# EAGLE design HW2_Schematics (EAGLE 9.3.0)
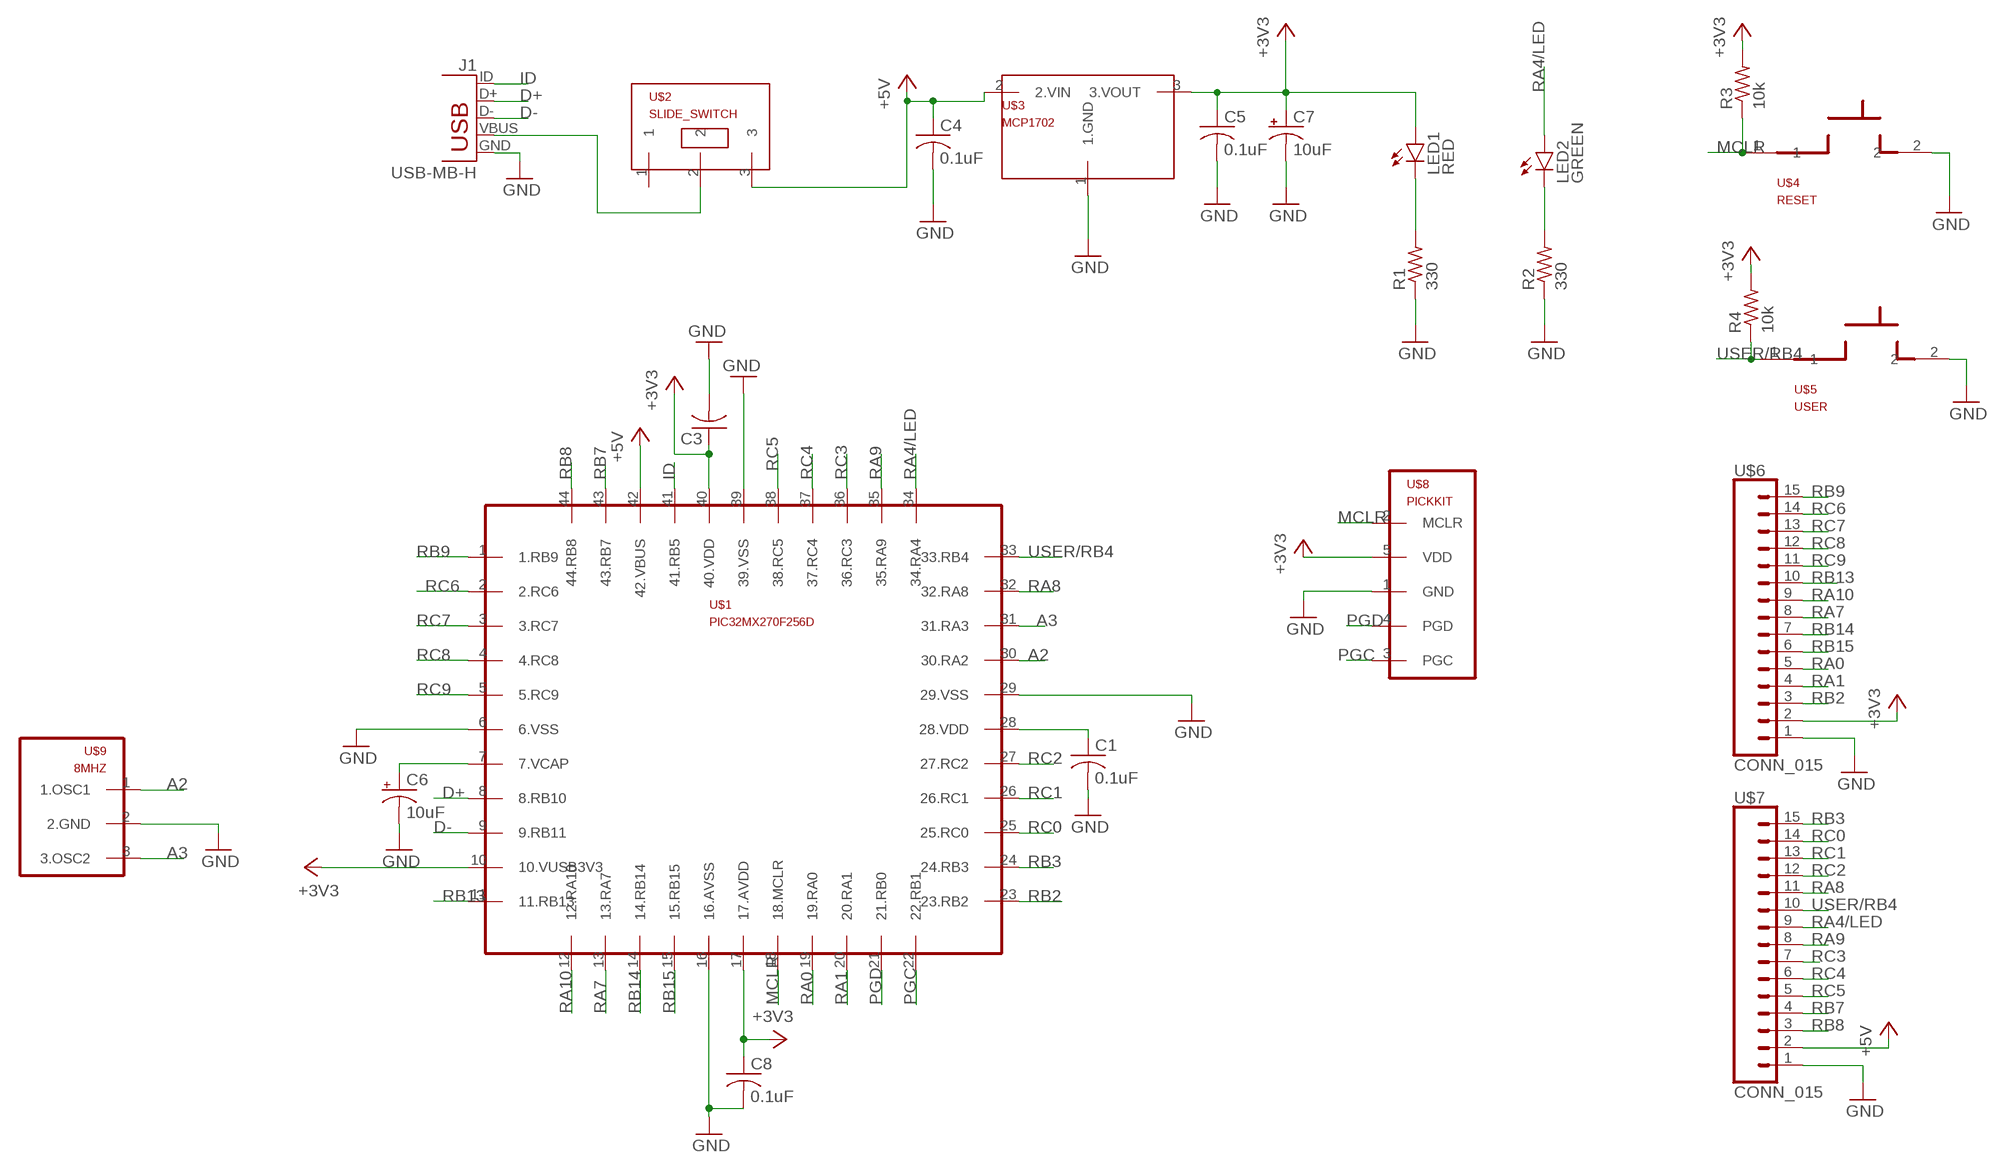
[diagram p0: schematic, sheet 1]

## Parts
C1  0.1uF  C-US025-025X050  [C025-025X050]
C3  C-US025-025X050  [C025-025X050]
C4  0.1uF  C-US025-025X050  [C025-025X050]
C5  0.1uF  C-US025-025X050  [C025-025X050]
C6  10uF  CPOL-USB45181B  [B45181B]
C7  10uF  CPOL-USB45181B  [B45181B]
C8  0.1uF  C-US025-025X050  [C025-025X050]
J1  USB-MB-H  [USB-MB-H]
LED1  RED  LED3MM  [LED3MM]
LED2  GREEN  LED3MM  [LED3MM]
R1  330  R-US_0207/10  [0207/10]
R2  330  R-US_0207/10  [0207/10]
R3  10k  R-US_0207/10  [0207/10]
R4  10k  R-US_0207/10  [0207/10]
U$1  PIC32MX270F256D  [TQFP44]
U$2  SLIDE_SWITCH  [SLIDE_SWITCH]
U$3  MCP1702  [TO92]
U$4  RESET  PUSHBUTTON  [PUSHBUTTON]
U$5  USER  PUSHBUTTON  [PUSHBUTTON]
U$6  CONN_015  [1X15]
U$7  CONN_015  [1X15]
U$8  PICKKIT  [1X05]
U$9  8MHZ  OSC  [OSC]

## Nets
+3V3: C3.1 C5.1 C7.+ C8.1 LED1.A R3.2 R4.2 U$1.10(10.VUSB3V3) U$1.17(17.AVDD) U$1.40(40.VDD) U$3.3(3.VOUT) U$6.2 U$8.5(VDD)
+5V: C4.1 U$1.42(42.VBUS) U$2.3 U$3.2(2.VIN) U$7.2
A2: U$1.30(30.RA2) U$9.1(1.OSC1)
A3: U$1.31(31.RA3) U$9.3(3.OSC2)
D+: J1.D+ U$1.8(8.RB10)
D-: J1.D- U$1.9(9.RB11)
GND: C1.2 C3.2 C4.2 C5.2 C6.- C7.- C8.2 J1.GND R1.1 R2.1 U$1.6(6.VSS) U$1.16(16.AVSS) U$1.29(29.VSS) U$1.39(39.VSS) U$3.1(1.GND) U$4.2 U$5.2 U$6.1 U$7.1 U$8.1(GND) U$9.2(2.GND)
ID: J1.ID U$1.41(41.RB5)
MCLR: R3.1 U$1.18(18.MCLR) U$4.1 U$8.2(MCLR)
N$1: J1.VBUS U$2.2
N$2: LED1.K(C) R1.2
N$3: LED2.K(C) R2.2
N$4: C6.+ U$1.7(7.VCAP)
N$5: C1.1 U$1.28(28.VDD)
PGC: U$1.22(22.RB1) U$8.3(PGC)
PGD: U$1.21(21.RB0) U$8.4(PGD)
RA0: U$1.19(19.RA0) U$6.5
RA1: U$1.20(20.RA1) U$6.4
RA4/LED: LED2.A U$1.34(34.RA4) U$7.9
RA7: U$1.13(13.RA7) U$6.8
RA8: U$1.32(32.RA8) U$7.11
RA9: U$1.35(35.RA9) U$7.8
RA10: U$1.12(12.RA10) U$6.9
RB2: U$1.23(23.RB2) U$6.3
RB3: U$1.24(24.RB3) U$7.15
RB7: U$1.43(43.RB7) U$7.4
RB8: U$1.44(44.RB8) U$7.3
RB9: U$1.1(1.RB9) U$6.15
RB13: U$1.11(11.RB13) U$6.10
RB14: U$1.14(14.RB14) U$6.7
RB15: U$1.15(15.RB15) U$6.6
RC0: U$1.25(25.RC0) U$7.14
RC1: U$1.26(26.RC1) U$7.13
RC2: U$1.27(27.RC2) U$7.12
RC3: U$1.36(36.RC3) U$7.7
RC4: U$1.37(37.RC4) U$7.6
RC5: U$1.38(38.RC5) U$7.5
RC6: U$1.2(2.RC6) U$6.14
RC7: U$1.3(3.RC7) U$6.13
RC8: U$1.4(4.RC8) U$6.12
RC9: U$1.5(5.RC9) U$6.11
USER/RB4: R4.1 U$1.33(33.RB4) U$5.1 U$7.10
Unconnected: U$2.1

## Library data of the parts
C1 C3-C5 C8 = rcl:C-US: CAPACITOR, American symbol; SPICEPREFIX: C
C6 C7 = rcl:CPOL-US: POLARIZED CAPACITOR, American symbol; SPICEPREFIX: C
J1 = Honghe_Qi_ME433_HW2_Library:USB: USB Connectors USB-B-PTH is fully proven SKU : PRT-00139/CONN-08278 USB-miniB is fully proven SKU : PRT-00587 USB-A-PCB is untested. USB-A-H is throughly reviewed, but untested. Spark Fun Electronics SKU : PRT-00437 USB-B-SMT is throughly reviewed, but untested. Needs silkscreen touching up. USB-A-S has not been used/tested USB-MB-H has not been used/tested USB-MICROB has been used. CONN-09505
LED1 LED2 = led:LED: LED OSRAM: - CHIPLED LG R971, LG N971, LY N971, LG Q971, LY Q971, LO R971, LY R971 LH N974, LH R974 LS Q976, LO Q976, LY Q976 LO Q996 - Hyper CHIPLED LW Q18S LB Q993, LB Q99A, LB R99A - SideLED LS A670, LO A670, LY A670, LG A670, LP A670 LB A673, LV A673, LT A673, LW A673 LH A674 LY A675 LS A676, LA A676, LO A676, LY A676, LW A676 LS A679, LY A679, LG A679 - Hyper Micro SIDELED® LS Y876, LA Y876, LO Y876, LY Y876 LT Y87S - SmartLED LW L88C, LW L88S LB L89C, LB L89S, LG L890 LS L89K, LO L89K, LY L89K LS L896, LA L896, LO L896, LY L896 - TOPLED LS T670, LO T670, LY T670, LG T670, LP T670 LSG T670, LSP T670, LSY T670, LOP T670, LYG T670 LG T671, LOG T671, LSG T671 LB T673, LV T673, LT T673, LW T673 LH T674 LS T676, LA T676, LO T676, LY T676, LB T676, LH T676, LSB T676, LW T676 LB T67C, LV T67C, LT T67C, LS T67K, LO T67K, LY T67K, LW E67C LS E67B, LA E67B, LO E67B, LY E67B, LB E67C, LV E67C, LT E67C LW T67C LS T679, LY T679, LG T679 LS T770, LO T770, LY T770, LG T770, LP T770 LB T773, LV T773, LT T773, LW T773 LH T774 LS E675, LA E675, LY E675, LS T675 LS T776, LA T776, LO T776, LY T776, LB T776 LHGB T686 LT T68C, LB T68C - Hyper Mini TOPLED® LB M676 - Mini TOPLED Santana® LG M470 LS M47K, LO M47K, LY M47K Source: http://www.osram.convergy.de LUXEON: - LUMILED® LXK2-PW12-R00, LXK2-PW12-S00, LXK2-PW14-U00, LXK2-PW14-V00 LXK2-PM12-R00, LXK2-PM12-S00, LXK2-PM14-U00 LXK2-PE12-Q00, LXK2-PE12-R00, LXK2-PE12-S00, LXK2-PE14-T00, LXK2-PE14-U00 LXK2-PB12-K00, LXK2-PB12-L00, LXK2-PB12-M00, LXK2-PB14-N00, LXK2-PB14-P00, LXK2-PB14-Q00 LXK2-PR12-L00, LXK2-PR12-M00, LXK2-PR14-Q00, LXK2-PR14-R00 LXK2-PD12-Q00, LXK2-PD12-R00, LXK2-PD12-S00 LXK2-PH12-R00, LXK2-PH12-S00 LXK2-PL12-P00, LXK2-PL12-Q00, LXK2-PL12-R00 Source: www.luxeon.com KINGBRIGHT: KA-3528ASYC Source: www.kingbright.com
R1-R4 = rcl:R-US_: RESISTOR, American symbol; SPICEPREFIX: R
U$1 = Honghe_Qi_ME433_HW2_Library:PIC32MX270F256D
U$2 = Honghe_Qi_ME433_HW2_Library:SLIDE_SWITCH
U$3 = Honghe_Qi_ME433_HW2_Library:MCP1702
U$4 U$5 = Honghe_Qi_ME433_HW2_Library:PUSHBUTTON
U$6 U$7 = Honghe_Qi_ME433_HW2_Library:CONN_015
U$8 = Honghe_Qi_ME433_HW2_Library:PICKKIT
U$9 = Honghe_Qi_ME433_HW2_Library:OSC

## Board
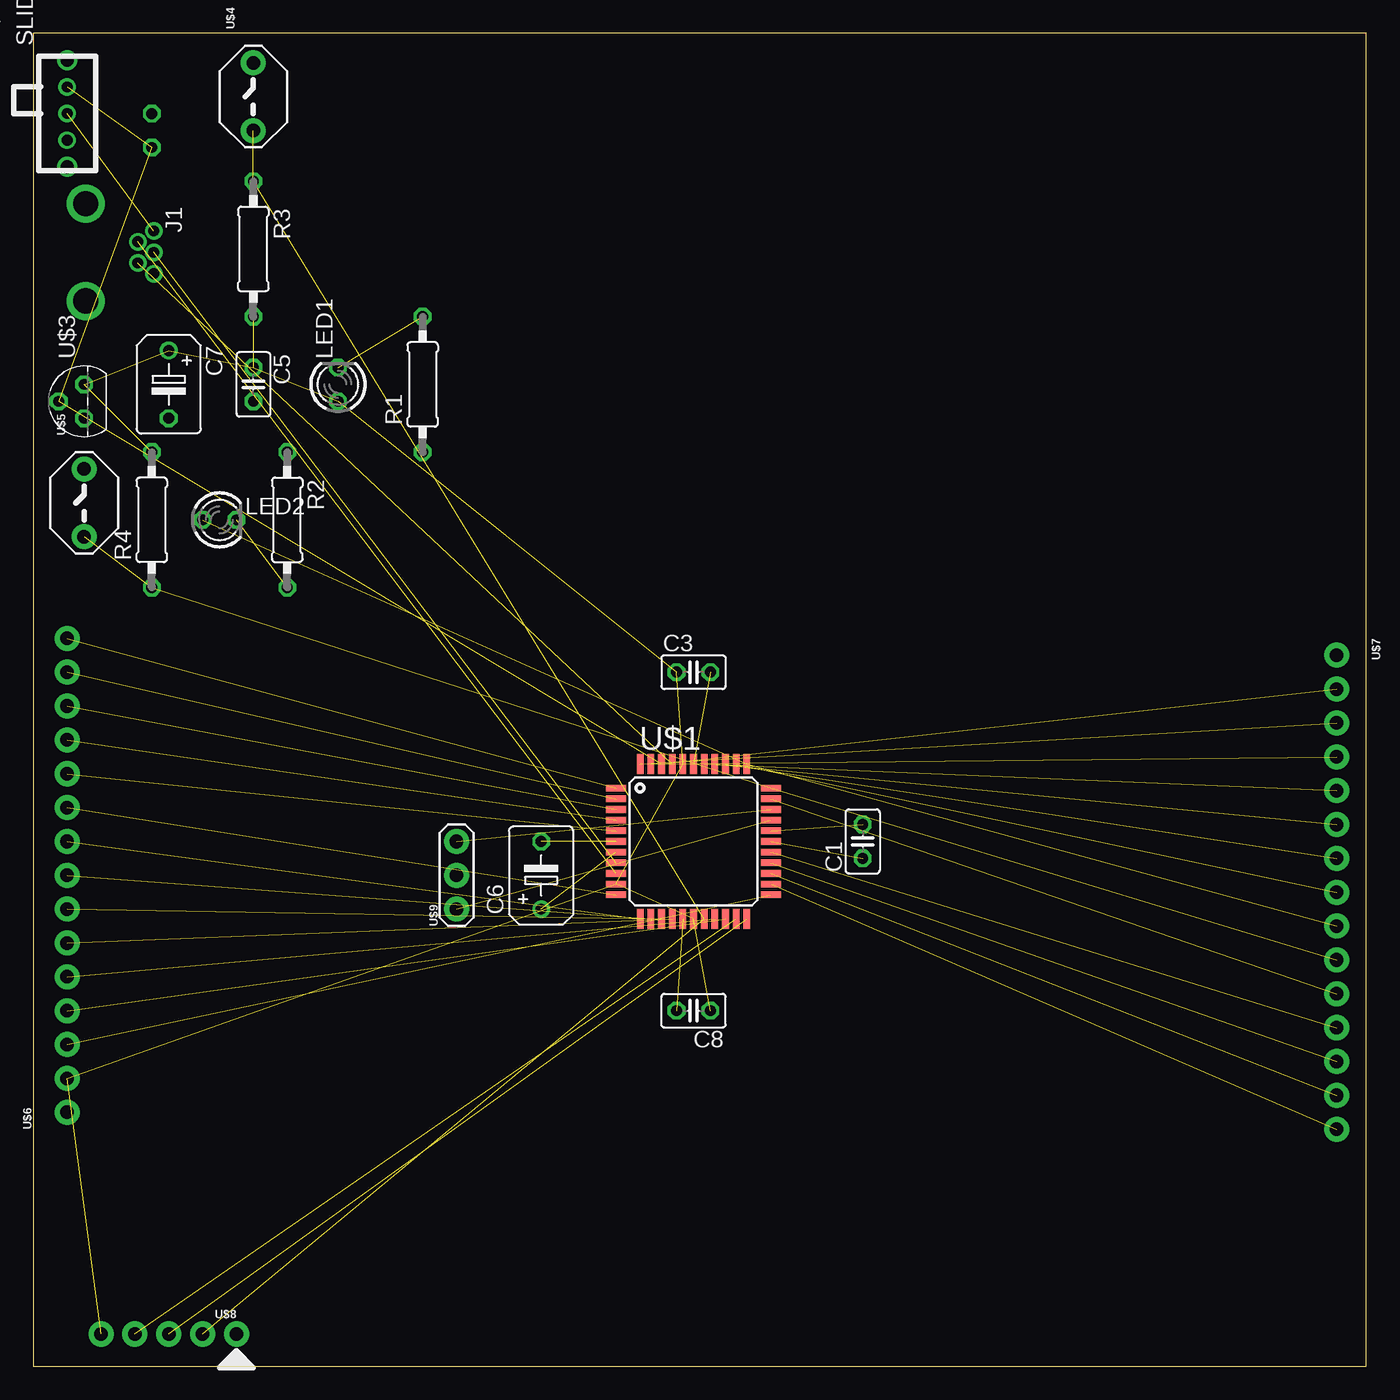
[diagram p1: board, top side]
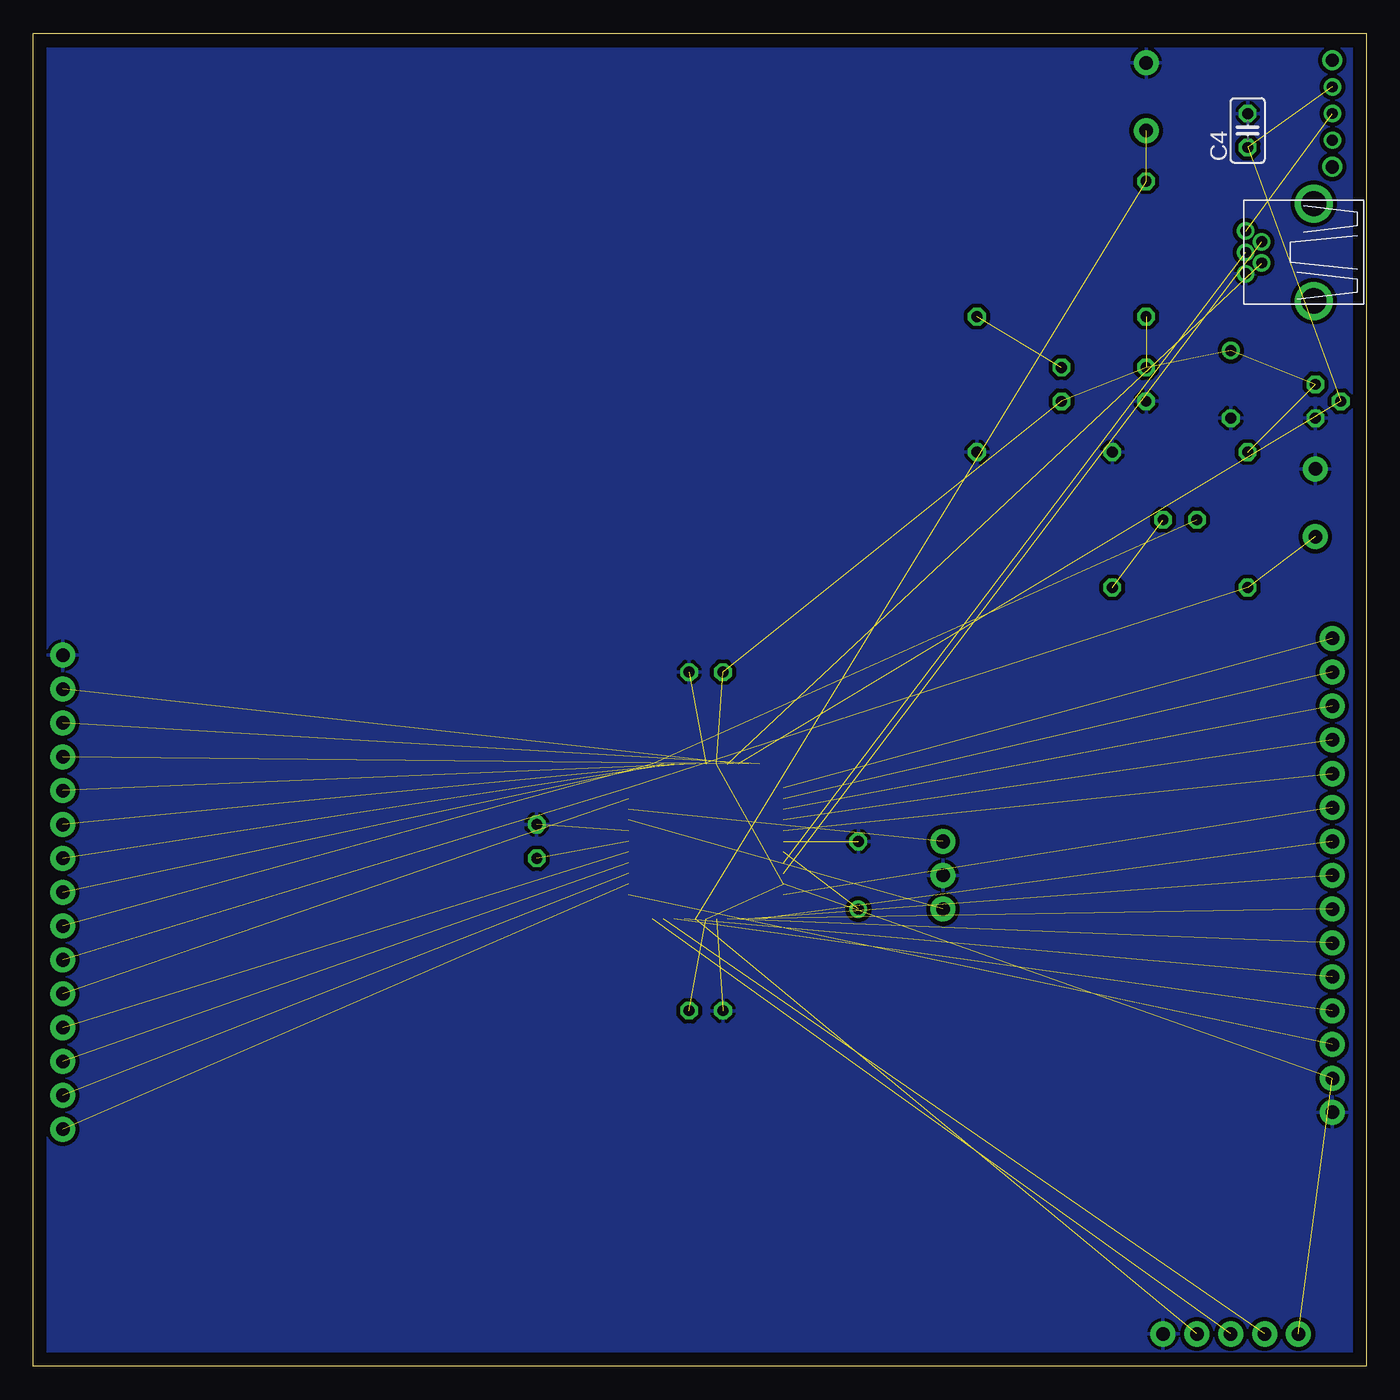
[diagram p2: board, bottom side, seen from below]

Size 100 x 100 mm. Coordinates in mm from the lower left corner, seen from the top.
Outline: 0,0 100,0 100,100 0,100 0,0
Copper layers (1*16): Top 0.035mm / dielectric 1.5mm / Bottom 0.035mm
Design rules "default": minimum track width 6mil, minimum drill 0.35mm, track to track 6mil, track to pad 6mil, pad to pad 6mil, via to via 6mil, smd to smd 6mil, copper to edge 40mil, drill to drill 6mil, minimum pad ring 10mil, minimum via ring 8mil, stop-mask expansion 4mil, vias tented up to drill 0mil, thermal gap 10mil

### Footprints (pad centres in the part's own frame; a part is rotated, then mirrored left to right if it is on the bottom)
C025-025X050 = drill 0.813 octagon: 1 -1.27,0; 2 1.27,0
B45181B = drill 0.813: + -2.54,0 | drill 0.813 octagon: - 2.54,0
USB-MB-H = drill 0.8: D+ 5.1,0; D- 3.9,0.8; GND 5.1,-1.6; ID 3.9,-0.8; VBUS 5.1,1.6 | drill 1.9: P$6 0,-3.65; P$7 0,3.65
LED3MM = drill 0.813 octagon: A -1.27,0; K 1.27,0
0207/10 = drill 0.813 octagon: 1 -5.08,0; 2 5.08,0
TQFP44 = smd 1.5 x 0.5: 1 -5.8,4; 2 -5.8,3.2; 3 -5.8,2.4; 4 -5.8,1.6; 5 -5.8,0.8; 6 -5.8,0; 7 -5.8,-0.8; 8 -5.8,-1.6; 9 -5.8,-2.4; 10 -5.8,-3.2; 11 -5.8,-4; 23 5.8,-4; 24 5.8,-3.2; 25 5.8,-2.4; 26 5.8,-1.6; 27 5.8,-0.8; 28 5.8,0; 29 5.8,0.8; 30 5.8,1.6; 31 5.8,2.4; 32 5.8,3.2; 33 5.8,4 | smd 0.5 x 1.5: 12 -4,-5.8; 13 -3.2,-5.8; 14 -2.4,-5.8; 15 -1.6,-5.8; 16 -0.8,-5.8; 17 0,-5.8; 18 0.8,-5.8; 19 1.6,-5.8; 20 2.4,-5.8; 21 3.2,-5.8; 22 4,-5.8; 34 4,5.8; 35 3.2,5.8; 36 2.4,5.8; 37 1.6,5.8; 38 0.8,5.8; 39 0,5.8; 40 -0.8,5.8; 41 -1.6,5.8; 42 -2.4,5.8; 43 -3.2,5.8; 44 -4,5.8
SLIDE_SWITCH = drill 0.8: 1 -2,0; 2 0,0; 3 2,0 | drill 1: P$3 -4,0; P$4 4,0
TO92 = drill 0.813 octagon: 1 -1.27,0; 2 0,1.905; 3 1.27,0
PUSHBUTTON = drill 1.016 pad 1.88: 1 -2.54,0; 2 2.54,0
1X15 = drill 1.016 pad 1.88: 1 -15.24,0; 2 -12.7,0; 3 -10.16,0; 4 -7.62,0; 5 -5.08,0; 6 -2.54,0; 7 0,0; 8 2.54,0; 9 5.08,0; 10 7.62,0; 11 10.16,0; 12 12.7,0; 13 15.24,0; 14 17.78,0; 15 20.32,0
1X05 = drill 1.016 pad 1.88: 1 0,0; 2 2.54,0; 3 5.08,0; 4 7.62,0; 5 10.16,0
OSC = drill 1.016 pad 1.88: 1 -2.54,0; 2 0,0; 3 2.54,0

### Placement (x,y rotation side)
C1  62.23,39.37 90 top
C3  49.53,52.07 0 top
C4  8.89,92.71 90 bottom
C5  16.51,73.66 270 top
C6  38.1,36.83 90 top
C7  10.16,73.66 270 top
C8  49.53,26.67 180 top
J1  3.94,83.57 0 top
LED1  22.86,73.66 90 top
LED2  13.97,63.5 0 top
R1  29.21,73.66 90 top
R2  19.05,63.5 270 top
R3  16.51,83.82 270 top
R4  8.89,63.5 90 top
U$1  49.53,39.37 0 top
U$2  2.54,93.98 90 top
U$3  3.81,72.39 90 top
U$4  16.51,95.25 90 top
U$5  3.81,64.77 90 top
U$6  2.54,34.29 90 top
U$7  97.79,38.1 270 top
U$8  15.24,2.41 180 top
U$9  31.75,36.83 90 top

### Tracks (layer width: path | path; a pad name or v marks a point on that pad's centre or on a via)
+3V3  (12 unrouted)
+5V  (4 unrouted)
A2  (1 unrouted)
A3  (1 unrouted)
D+  (1 unrouted)
D-  (1 unrouted)
GND  (4 unrouted)
  pour Bottom (isolate 0.305): 1.27,99.06 99.69,99.06 99.69,0.25 0.51,0.25 0.51,99.06 0.51,99.06
ID  (1 unrouted)
MCLR  (3 unrouted)
N$1  (1 unrouted)
N$2  (1 unrouted)
N$3  (1 unrouted)
N$4  (1 unrouted)
N$5  (1 unrouted)
PGC  (1 unrouted)
PGD  (1 unrouted)
RA0  (1 unrouted)
RA1  (1 unrouted)
RA4/LED  (2 unrouted)
RA7  (1 unrouted)
RA8  (1 unrouted)
RA9  (1 unrouted)
RA10  (1 unrouted)
RB2  (1 unrouted)
RB3  (1 unrouted)
RB7  (1 unrouted)
RB8  (1 unrouted)
RB9  (1 unrouted)
RB13  (1 unrouted)
RB14  (1 unrouted)
RB15  (1 unrouted)
RC0  (1 unrouted)
RC1  (1 unrouted)
RC2  (1 unrouted)
RC3  (1 unrouted)
RC4  (1 unrouted)
RC5  (1 unrouted)
RC6  (1 unrouted)
RC7  (1 unrouted)
RC8  (1 unrouted)
RC9  (1 unrouted)
USER/RB4  (3 unrouted)